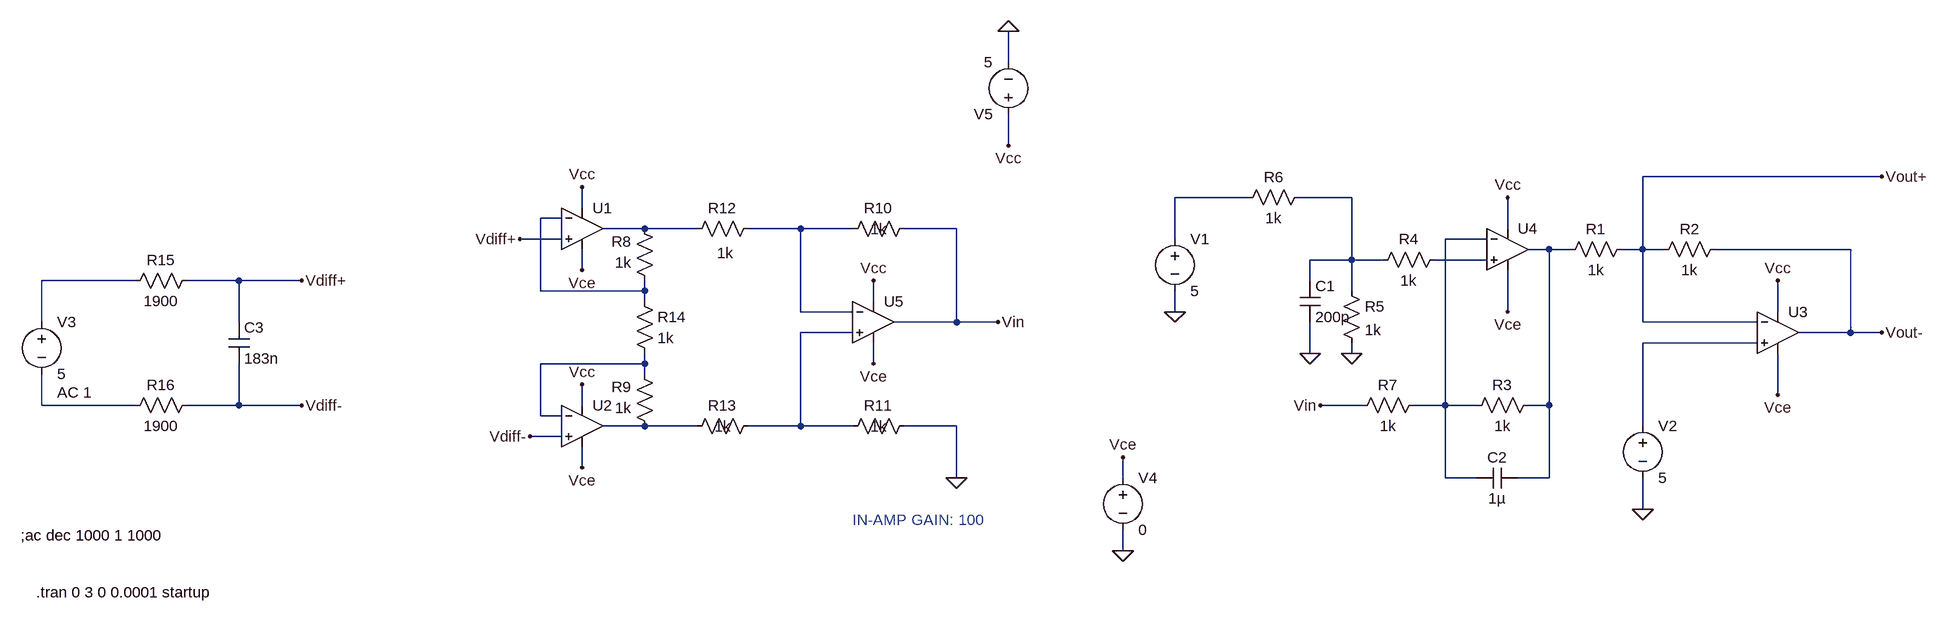
[diagram p0: schematic Differential.asc]
Differential.asc, the LTspice schematic file:
Version 4
SHEET 1 880 772
WIRE -704 -64 -704 -112
WIRE -704 64 -704 16
WIRE 640 112 272 112
WIRE -336 144 -448 144
WIRE -176 144 -256 144
WIRE -1360 160 -1360 128
WIRE -1392 176 -1424 176
WIRE -1264 192 -1328 192
WIRE -1184 192 -1264 192
WIRE -1024 192 -1104 192
WIRE -944 192 -1024 192
WIRE -784 192 -864 192
WIRE 64 192 64 144
WIRE -1392 208 -1456 208
WIRE -448 208 -448 144
WIRE 32 208 -32 208
WIRE 128 224 96 224
WIRE 160 224 128 224
WIRE 272 224 272 112
WIRE 272 224 240 224
WIRE 304 224 272 224
WIRE 592 224 384 224
WIRE -176 240 -176 144
WIRE -176 240 -240 240
WIRE -128 240 -176 240
WIRE 32 240 -48 240
WIRE -1360 256 -1360 224
WIRE -2048 272 -2192 272
WIRE -1888 272 -1968 272
WIRE -1792 272 -1888 272
WIRE -240 272 -240 240
WIRE -1424 288 -1424 176
WIRE -1264 288 -1264 272
WIRE -1264 288 -1424 288
WIRE -176 288 -176 240
WIRE -1264 304 -1264 288
WIRE -912 304 -912 272
WIRE -1024 320 -1024 192
WIRE -944 320 -1024 320
WIRE -448 320 -448 288
WIRE 64 320 64 256
WIRE 480 320 480 272
WIRE -2192 336 -2192 272
WIRE -1888 336 -1888 272
WIRE -784 336 -784 192
WIRE -784 336 -880 336
WIRE -720 336 -784 336
WIRE 272 336 272 224
WIRE 448 336 272 336
WIRE -944 352 -1024 352
WIRE 592 352 592 224
WIRE 592 352 512 352
WIRE 640 352 592 352
WIRE 448 368 272 368
WIRE -240 384 -240 336
WIRE -176 384 -176 368
WIRE -1264 400 -1264 384
WIRE -1264 400 -1424 400
WIRE -912 400 -912 368
WIRE -1264 416 -1264 400
WIRE 480 448 480 384
WIRE -2192 464 -2192 416
WIRE -2048 464 -2192 464
WIRE -1888 464 -1888 400
WIRE -1888 464 -1968 464
WIRE -1792 464 -1888 464
WIRE -1360 464 -1360 432
WIRE -160 464 -224 464
WIRE -32 464 -32 208
WIRE -32 464 -80 464
WIRE 16 464 -32 464
WIRE 128 464 128 224
WIRE 128 464 96 464
WIRE -1424 480 -1424 400
WIRE -1392 480 -1424 480
WIRE -1264 496 -1328 496
WIRE -1184 496 -1264 496
WIRE -1024 496 -1024 352
WIRE -1024 496 -1104 496
WIRE -944 496 -1024 496
WIRE -784 496 -864 496
WIRE 272 496 272 368
WIRE -1392 512 -1440 512
WIRE -1360 560 -1360 528
WIRE -784 576 -784 496
WIRE -528 576 -528 544
WIRE -32 576 -32 464
WIRE 16 576 -32 576
WIRE 128 576 128 464
WIRE 128 576 80 576
WIRE 272 624 272 576
WIRE -528 688 -528 656
FLAG -240 384 0
FLAG -176 384 0
FLAG -448 320 0
FLAG 272 624 0
FLAG -784 576 0
FLAG -1440 512 Vdiff-
FLAG -1360 432 Vcc
FLAG -912 272 Vcc
FLAG -1360 560 Vce
FLAG -1360 256 Vce
FLAG -912 400 Vce
FLAG -1360 128 Vcc
FLAG -1456 208 Vdiff+
FLAG -720 336 Vin
FLAG -224 464 Vin
FLAG -1792 272 Vdiff+
FLAG -1792 464 Vdiff-
FLAG -528 688 0
FLAG -528 544 Vce
FLAG -704 -112 0
FLAG -704 64 Vcc
FLAG 480 272 Vcc
FLAG 480 448 Vce
FLAG 64 144 Vcc
FLAG 64 320 Vce
FLAG 640 112 Vout+
FLAG 640 352 Vout-
SYMBOL res 256 208 R90
WINDOW 0 0 56 VBottom 2
WINDOW 3 32 56 VTop 2
SYMATTR InstName R1
SYMATTR Value 1k
SYMBOL res 400 208 R90
WINDOW 0 0 56 VBottom 2
WINDOW 3 32 56 VTop 2
SYMATTR InstName R2
SYMATTR Value 1k
SYMBOL res 112 448 R90
WINDOW 0 0 56 VBottom 2
WINDOW 3 32 56 VTop 2
SYMATTR InstName R3
SYMATTR Value 1k
SYMBOL res -32 224 R90
WINDOW 0 0 56 VBottom 2
WINDOW 3 32 56 VTop 2
SYMATTR InstName R4
SYMATTR Value 1k
SYMBOL cap -256 272 R0
SYMATTR InstName C1
SYMATTR Value 200p
SYMBOL res -192 272 R0
SYMATTR InstName R5
SYMATTR Value 1k
SYMBOL res -240 128 R90
WINDOW 0 0 56 VBottom 2
WINDOW 3 32 56 VTop 2
SYMATTR InstName R6
SYMATTR Value 1k
SYMBOL voltage -448 192 R0
WINDOW 123 0 0 Left 0
WINDOW 39 0 0 Left 0
SYMATTR InstName V1
SYMATTR Value 5
SYMBOL voltage 272 480 R0
WINDOW 123 0 0 Left 0
WINDOW 39 0 0 Left 0
SYMATTR InstName V2
SYMATTR Value 5
SYMBOL res -64 448 R90
WINDOW 0 0 56 VBottom 2
WINDOW 3 32 56 VTop 2
SYMATTR InstName R7
SYMATTR Value 1k
SYMBOL cap 80 560 R90
WINDOW 0 0 32 VBottom 2
WINDOW 3 32 32 VTop 2
SYMATTR InstName C2
SYMATTR Value 1µ
SYMBOL res -1248 288 R180
WINDOW 0 36 76 Left 2
WINDOW 3 36 44 Left 2
SYMATTR InstName R8
SYMATTR Value 1k
SYMBOL res -1248 512 R180
WINDOW 0 36 76 Left 2
WINDOW 3 36 44 Left 2
SYMATTR InstName R9
SYMATTR Value 1k
SYMBOL res -848 176 R90
WINDOW 0 0 56 VBottom 2
WINDOW 3 32 56 VBottom 2
SYMATTR InstName R10
SYMATTR Value 1k
SYMBOL res -848 480 R90
WINDOW 0 0 56 VBottom 2
WINDOW 3 32 56 VBottom 2
SYMATTR InstName R11
SYMATTR Value 1k
SYMBOL res -1088 176 R90
WINDOW 0 0 56 VBottom 2
WINDOW 3 69 52 VBottom 2
SYMATTR InstName R12
SYMATTR Value 1k
SYMBOL res -1088 480 R90
WINDOW 0 0 56 VBottom 2
WINDOW 3 32 56 VBottom 2
SYMATTR InstName R13
SYMATTR Value 1k
SYMBOL res -1280 288 R0
WINDOW 3 36 72 Left 2
SYMATTR Value 1k
SYMATTR InstName R14
SYMBOL res -1952 256 R90
WINDOW 0 0 56 VBottom 2
WINDOW 3 32 56 VTop 2
SYMATTR InstName R15
SYMATTR Value 1900
SYMBOL cap -1904 336 R0
SYMATTR InstName C3
SYMATTR Value 183n
SYMBOL res -1952 448 R90
WINDOW 0 0 56 VBottom 2
WINDOW 3 32 56 VTop 2
SYMATTR InstName R16
SYMATTR Value 1900
SYMBOL voltage -2192 320 R0
WINDOW 123 24 124 Left 2
WINDOW 39 0 0 Left 0
SYMATTR Value2 AC 1
SYMATTR InstName V3
SYMATTR Value 5
SYMBOL voltage -528 560 R0
WINDOW 123 0 0 Left 0
WINDOW 39 0 0 Left 0
SYMATTR InstName V4
SYMATTR Value 0
SYMBOL voltage -704 32 R180
WINDOW 123 0 0 Left 0
WINDOW 39 0 0 Left 0
SYMATTR InstName V5
SYMATTR Value 5
SYMBOL OpAmps\\UniversalOpAmp -1360 192 R0
SYMATTR InstName U1
SYMBOL OpAmps\\UniversalOpAmp -1360 496 R0
SYMATTR InstName U2
SYMBOL OpAmps\\UniversalOpAmp 480 352 R0
SYMATTR InstName U3
SYMBOL OpAmps\\UniversalOpAmp 64 224 R0
SYMATTR InstName U4
SYMBOL OpAmps\\UniversalOpAmp -912 336 R0
SYMATTR InstName U5
TEXT -944 640 Left 2 ;IN-AMP GAIN: 100
TEXT -2224 664 Left 2 !;ac dec 1000 1 1000
TEXT -2200 752 Left 2 !.tran 0 3 0 0.0001 startup

The netlist it stands for:
* Differential.asc
R1 Vout+ N007 1k
R2 Vout- Vout+ 1k
R3 N007 N006 1k
R4 N008 N002 1k
C1 N002 0 200p
R5 N002 0 1k
R6 N002 N001 1k
V1 N001 0 5
V2 N011 0 5
R7 N006 Vin 1k
C2 N007 N006 1µ
R8 N003 N004 1k
R9 N014 N012 1k
R10 Vin N005 1k
R11 0 N010 1k
R12 N005 N004 1k
R13 N010 N014 1k
R14 N003 N012 1k
R15 Vdiff+ N009 1900
C3 Vdiff+ Vdiff- 183n
R16 Vdiff- N013 1900
V3 N009 N013 5 AC 1
V4 Vce 0 0
V5 Vcc 0 5
XU1 Vdiff+ N003 Vcc Vce N004 level1 Avol=1Meg GBW=10Meg Vos=0 En=0 Enk=0 In=0 Ink=0 Rin=500Meg  ; pins In+ In- V+ V- OUT
XU2 Vdiff- N012 Vcc Vce N014 level1 Avol=1Meg GBW=10Meg Vos=0 En=0 Enk=0 In=0 Ink=0 Rin=500Meg  ; pins In+ In- V+ V- OUT
XU3 N011 Vout+ Vcc Vce Vout- level1 Avol=1Meg GBW=10Meg Vos=0 En=0 Enk=0 In=0 Ink=0 Rin=500Meg  ; pins In+ In- V+ V- OUT
XU4 N008 N006 Vcc Vce N007 level1 Avol=1Meg GBW=10Meg Vos=0 En=0 Enk=0 In=0 Ink=0 Rin=500Meg  ; pins In+ In- V+ V- OUT
XU5 N010 N005 Vcc Vce Vin level1 Avol=1Meg GBW=10Meg Vos=0 En=0 Enk=0 In=0 Ink=0 Rin=500Meg  ; pins In+ In- V+ V- OUT
* IN-AMP GAIN: 100
;ac dec 1000 1 1000
.tran 0 3 0 0.0001 startup
.lib UniversalOpAmp1.lib
.backanno
.end